# EAGLE schematic UE0083-Modulo PWM-V1.fsch (EAGLE 9.7.0)
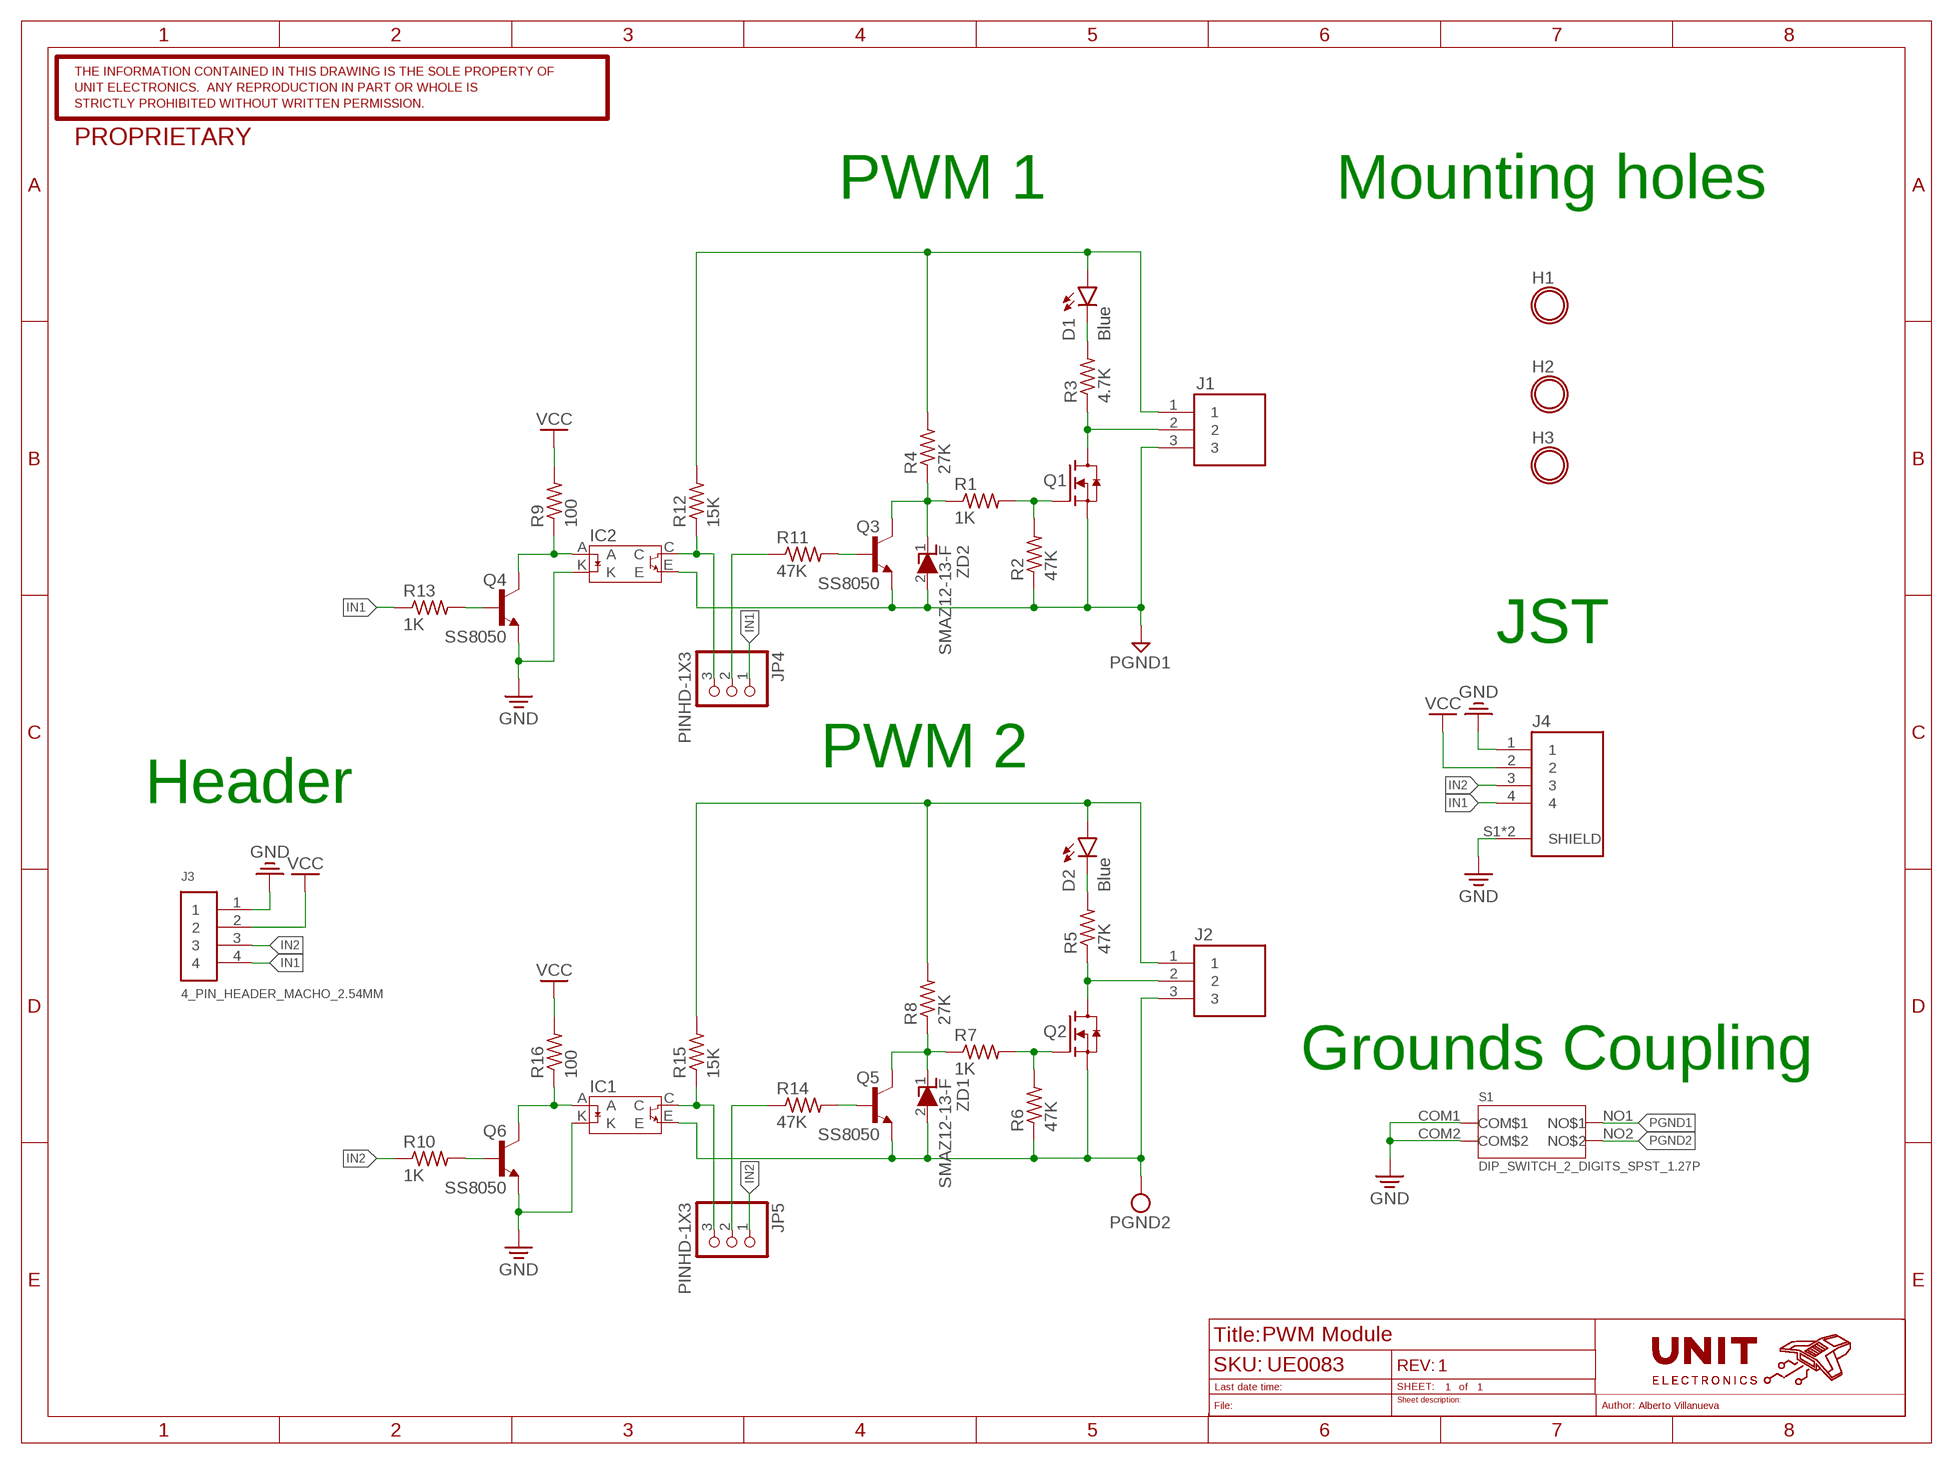
[diagram p0: schematic, sheet 1]

## Parts
D1  Blue  LED_SMD_0402  [0402_D]
D2  Blue  LED_SMD_0402  [0402_D]
H1  HOLE_PADM2-THICK  [M2-THICK-OUTLINE]
H2  HOLE_PADM2-THICK  [M2-THICK-OUTLINE]
H3  HOLE_PADM2-THICK  [M2-THICK-OUTLINE]
IC1  EL3H7BTA-G  [SSOP-4]
IC2  EL3H7BTA-G  [SSOP-4]
J1  BORNERA-KF301-3P  [KF301-5MM-3P]
J2  BORNERA-KF301-3P  [KF301-5MM-3P]
J3  4_PIN_HEADER_MACHO_2.54MM  4_PIN_HEADER_MACHO_2.54MMROUNDED  [4_PIN_HEADER_MACHO_2.54MM_ROUNDED]
J4  QWIIC_JST_SR_4PINES_1MMBM04B-SRSS-TB(LF)(SN)  [SMD,P=1MM,4P,VERTICAL]
JP4  PINHD-1X3  PINHD-1X31X3_SILKSCREEN  [1X3_PIN_HEADER_2.54MM_SILKSCREEN]
JP5  PINHD-1X3  PINHD-1X31X3_SILKSCREEN  [1X3_PIN_HEADER_2.54MM_SILKSCREEN]
Q1  HL4410  [SOP-8]
Q2  HL4410  [SOP-8]
Q3  SS8050  [TRANS_SS8050-G]
Q4  SS8050  [TRANS_SS8050-G]
Q5  SS8050  [TRANS_SS8050-G]
Q6  SS8050  [TRANS_SS8050-G]
R1  1K  RESISTOR_06030402_R  [0402_R]
R2  47K  RESISTOR_06030402_R  [0402_R]
R3  4.7K  RESISTOR_06030402_R  [0402_R]
R4  27K  RESISTOR_06030402_R  [0402_R]
R5  47K  RESISTOR_06030402_R  [0402_R]
R6  47K  RESISTOR_06030402_R  [0402_R]
R7  1K  RESISTOR_06030402_R  [0402_R]
R8  27K  RESISTOR_06030402_R  [0402_R]
R9  100  RESISTOR_SMD1206_R  [R1206]
R10  1K  RESISTOR_06030402_R  [0402_R]
R11  47K  RESISTOR_SMD0402_R  [0402_R]
R12  15K  RESISTOR_SMD  [0603_R]
R13  1K  RESISTOR_SMD0402_R  [0402_R]
R14  47K  RESISTOR_SMD0402_R  [0402_R]
R15  15K  RESISTOR_SMD  [0603_R]
R16  100  RESISTOR_SMD1206_R  [R1206]
S1  DIP_SWITCH_2_DIGITS_SPST_1.27P  [SMD-4P,4.1X5.4MM]
ZD1  SMAZ12-13-F  [SMA]
ZD2  SMAZ12-13-F  [SMA]

## Nets
GND: IC1.K IC2.K J3.1 J4.1 J4.S1(SHIELD) J4.S2(SHIELD) Q4.2(E) Q6.2(E) S1.COM1(COM$1) S1.COM2(COM$2)
IN1: J3.4 J4.4 JP4.1 R13.1
IN2: J3.3 J4.3 JP5.1 R10.1
N$1: Q3.1(B) R11.2
N$2: IC2.C JP4.3 R12.1
N$4: Q4.1(B) R13.2
N$5: JP4.2 R11.1
N$7: Q5.1(B) R14.2
N$8: IC1.C JP5.3 R15.1
N$9: JP5.2 R14.1
N$10: Q6.1(B) R10.2
N$171: IC1.A Q6.3(C) R16.1
N$175: D2.A J2.1 R8.2 R15.2
N$176: D2.C R5.2
N$177: Q5.3(C) R7.1 R8.1 ZD1.1(K)
N$178: Q2.P$4(G) R6.2 R7.2
N$180: J2.2 Q2.P$5(D) Q2.P$6(D) Q2.P$7(D) Q2.P$8(D) R5.1
N$182: IC2.A Q4.3(C) R9.1
N$184: Q3.3(C) R1.1 R4.1 ZD2.1(K)
N$185: D1.A J1.1 R4.2 R12.2
N$186: D1.C R3.2
N$188: Q1.P$4(G) R1.2 R2.2
N$190: J1.2 Q1.P$5(D) Q1.P$6(D) Q1.P$7(D) Q1.P$8(D) R3.1
PGND1: IC2.E J1.3 Q1.P$1(S) Q1.P$2(S) Q1.P$3(S) Q3.2(E) R2.1 S1.NO1(NO$1) ZD2.2(A)
PGND2: IC1.E J2.3 Q2.P$1(S) Q2.P$2(S) Q2.P$3(S) Q5.2(E) R6.1 S1.NO2(NO$2) ZD1.2(A)
VCC: J3.2 J4.2 R9.2 R16.2

## Notes on the sheet
- PWM 1 | Mounting holes
- JST
- PWM 2
- Header
- Grounds Coupling
- PWM Module
- UE0083 | 1
- Alberto Villanueva

## Library data of the parts
D1 D2 = Unit_Biblioteca - Optoelectronica:LED_SMD: LED SMD diferentes medidas Source: Datasheet <chrome-extension://efaidnbmnnnibpcajpcglclefindmkaj/https://datasheet.lcsc.com/szlcsc/1811081723_UNI-ROYAL-Uniroyal-Elec-0603WAF6803T5E_C25822.pdf> SKU: Propietario: UNIT Electronics Desarrollador:Federico Hidalgo; CLASS: Optoelectronics; DESCRIPTION: Chip LED; SKU: L_0402
H1-H3 = UNIT_Biblioteca - Mechanical:HOLE_PAD: Mounting holes with pad around Autor: Adrián Rabadan
IC1 IC2 = Unit_Biblioteca - Optoelectronica:EL3H7BTA-G: EL3H7(B)(TA)-G 4 PIN ULTRA SMALL SSOP PHOTOTRANSISTOR PHOTOCOUPLER Source: Datasheet <https://www.lcsc.com/datasheet/lcsc_datasheet_1811131510_Everlight-Elec-EL3H7-B-TA-G_C32565.pdf> SKU: N/A Propietario: UNIT Electronics Desarrollador: Alberto Villanueva; CLASS: Optoelectronics; DESCRIPTION: 80V 3.75kV 50mA 100mV@1mA,10mA 1 6V 1.2V DC SSOP-4-1.27mm Transistor, Photovoltaic Output Optoisolators ROHS; MANUFACTURER_NAME: Everlight Elec; MANUFACTURER_PART_NUMBER: EL3H7(B)(TA)-G; SKU: TST0126; VENDOR_PART_NUMBER: C32565; VENDOR_PRICE-STOCK: https://www.lcsc.com/product-detail/Transistor-Photovoltaic-Output-Optoisolators_Everlight-Elec-EL3H7-B-TA-G_C32565.html
J1 J2 = UNIT_Biblioteca Conectores:BORNERA-KF301-3P: Terminal Block 5mm Pitch 3 Poles Source: Datasheet <http://www.handsontec.com/dataspecs/terminal block-5mm.pdf> UNIT_PART_NUMBER:AR0315 AUTOR:Federico Hidalgo M; CLASS: Connectors; DESCRIPTION: 1x3P -30℃~+120℃ 17A 250V Blue 14~22 Direct Insert 5mm 1.5 1 3 Plugin,P=5mm Screw Terminal Blocks ROHS; MANUFACTURER_NAME: Cixi Kefa Elec; MANUFACTURER_PART_NUMBER: KF301-5.0-3P; SKU: SMT0056; VENDOR_PART_NUMBER: AR0315; VENDOR_PRICE-STOCK: https://uelectronics.com/producto/bornera-kf301-de-2-3-4-pines-5mm-paso-b/?attribute_bornera=3+pines
J3 = UNIT_Biblioteca Conectores:4_PIN_HEADER_MACHO_2.54MM: Header Macho Tira de 4 Pines 2.54mm Source: Datasheet <https://www.sparkfun.com/datasheets/Components/longerheaders.pdf> Propietario: UNIT Electronics Desarrollador: Alberto Villanueva; CLASS: Connectors; DESCRIPTION: Plugin,P=2.54 Pin Headers ROHS; MANUFACTURER_NAME: XYECONN; MANUFACTURER_PART_NUMBER: PZ2.54-UP1D-40A; SKU: SMT0040; VENDOR_PART_NUMBER: AR0164; VENDOR_PRICE-STOCK: https://uelectronics.com/producto/tira-header-macho-40p-2-54mm-diferentes-colores/
J4 = UNIT_Biblioteca Conectores:QWIIC_JST_SR_4PINES_1MM: Conector JST SR 4 Pines BM04B-SRSS-TB(LF)(SN) Source: Datasheet <https://datasheet.lcsc.com/szlcsc/2006181005_XKB-Connectivity-X1002WVS-04L-HF-LPSN_C400379.pdf> SKU: AR2423 Propietario: UNIT Electronics Desarrollador:Federico Hidalgo; CLASS: Connector; DESCRIPTION: Conector JST 4 Pines Vertical BM04B-SRSS-TB(LF)(SN); MANUFACTURER_NAME: JST; MANUFACTURER_PART_NUMBER: BM04B-SRSS-TB(LF)(SN); SKU: SMT0055; VENDOR_PART_NUMBER: AR2423; VENDOR_PRICE-STOCK: https://uelectronics.com/producto/conector-jst-sr-4-pines-vertical-bm04b-srss-tblfsn/
JP4 JP5 = UNIT_Biblioteca Conectores:PINHD-1X3: PIN HEADER; CLASS: Connectors; DESCRIPTION: Plugin,P=2.54 Pin Headers ROHS; MANUFACTURER_NAME: XYECONN; MANUFACTURER_PART_NUMBER: PZ2.54-UP1D-40A; SKU: SMT0040; VENDOR_PART_NUMBER: AR0164; VENDOR_PRICE-STOCK: https://uelectronics.com/producto/tira-header-macho-40p-2-54mm-diferentes-colores/
Q1 Q2 = UNIT_Biblioteca - Elementos Activos:HL4410: HL 4410 NChannel MOSFET 30V 18A 7mΩ 2.5V 1 N-Channel SOP-8 MOSFETs ROHS Source: Datasheet <https://www.lcsc.com/datasheet/lcsc_datasheet_2308071627_HL-4410_C7471105.pdf> SKU: n/a Propietario: UNIT Electronics Desarrollador: Alberto Villanueva; CLASS: Transistors; DESCRIPTION: 30V 18A 5W 11mΩ@4.5V,10A 1.5V@250uA 1 N-Channel SOP-8 MOSFETs ROHS; MANUFACTURER_NAME: HL; MANUFACTURER_PART_NUMBER: 4410; VENDOR_PART_NUMBER: C7471105; VENDOR_PRICE-STOCK: https://www.lcsc.com/product-detail/MOSFETs_HL-4410_C7471105.html
Q3-Q6 = UNIT_Biblioteca - Elementos Activos:SS8050: SS8050 NPN Transistor Bipolar (BJT) Transistor NPN 25 V 1.5 A 100MHz 300 mW Surface Mount SOT-23-3 Source: Datasheet <https://uelectronics.com/wp-content/uploads/2021/04/1811052004_Changjiang-Electronics-Tech-CJ-SS8050_C2150.pdf> SKU: AR2124 Propietario: UNIT Electronics Desarrollador: Alberto Villanueva; DESCRIPTION: Bipolar (BJT) Transistor NPN 25 V 1.5 A 100MHz 300 mW Surface Mount SOT-23-3; HEIGHT: 1.14 mm; MANUFACTURER_NAME: Comchip Technology; MANUFACTURER_PART_NAME: SS8050; UNIT_PART_NUMBER: AR2124; UNIT_PRICE-STOCK: https://uelectronics.com/producto/transistor-npn-1-5a-25v-ss8050/; WIDTH: 2.9 mm
R1-R8 R10 = UNIT_Bliblioteca - Elementos Pasivos:RESISTOR_0603: Resistencias SMD 0603 6.3mm diámetro x 7.7mm Source: Datasheet <chrome-extension://efaidnbmnnnibpcajpcglclefindmkaj/https://datasheet.lcsc.com/szlcsc/1811081723_UNI-ROYAL-Uniroyal-Elec-0603WAF6803T5E_C25822.pdf> SKU: Propietario: UNIT Electronics Desarrollador: Federico Hidalgo; CLASS: Resistor; DESCRIPTION: Chip Resistor 0402 1%; SKU: R_0402
R9 R16 = UNIT_Bliblioteca - Elementos Pasivos:RESISTOR_SMD: Resistencias SMD Source: Datasheet <chrome-extension://efaidnbmnnnibpcajpcglclefindmkaj/https://datasheet.lcsc.com/szlcsc/1811081723_UNI-ROYAL-Uniroyal-Elec-0603WAF6803T5E_C25822.pdf> SKU: Propietario: UNIT Electronics Desarrollador: Federico Hidalgo; CLASS: Resistor
R11 R13 R14 = UNIT_Bliblioteca - Elementos Pasivos:RESISTOR_SMD: Resistencias SMD Source: Datasheet <chrome-extension://efaidnbmnnnibpcajpcglclefindmkaj/https://datasheet.lcsc.com/szlcsc/1811081723_UNI-ROYAL-Uniroyal-Elec-0603WAF6803T5E_C25822.pdf> SKU: Propietario: UNIT Electronics Desarrollador: Federico Hidalgo; CLASS: Resistor; DESCRIPTION: Chip Resistor 0402 1%; SKU: R_0402
R12 R15 = UNIT_Bliblioteca - Elementos Pasivos:RESISTOR_SMD: Resistencias SMD Source: Datasheet <chrome-extension://efaidnbmnnnibpcajpcglclefindmkaj/https://datasheet.lcsc.com/szlcsc/1811081723_UNI-ROYAL-Uniroyal-Elec-0603WAF6803T5E_C25822.pdf> SKU: Propietario: UNIT Electronics Desarrollador: Federico Hidalgo; CLASS: Resistor; DESCRIPTION: Chip Resistor 0603 1%; SKU: R_0603
S1 = UNIT_Bilbioteca - Switches:DIP_SWITCH_2_DIGITS_SPST_1.27P: DIP Switch 4 Pin 1.27P 2 positions SPST Black Flat toggle, slotted SMD-4P,4.1x5.4mm DIP Switches ROHS Source: Datasheet <https://www.lcsc.com/datasheet/lcsc_datasheet_2309041406_DongGuan-KINGTEK-Industrial-Co--LTD-DSHP02TSGET_C40735.pdf> SKU: n/a Propietario: UNIT Electronics Desarrollador: Alberto Villanueva; CLASS: Switch; DESCRIPTION: 2 positions SPST Black Flat toggle, slotted SMD-4P,4.1x5.4mm DIP Switches ROHS; MANUFACTURER_NAME: DongGuan KINGTEK Industrial Co.,LTD; MANUFACTURER_PART_NUMBER: DSHP02TSGET; SKU: N/A; VENDOR_PART_NUMBER: C40735; VENDOR_PRICE-STOCK: https://www.lcsc.com/product-detail/DIP-Switches_DongGuan-KINGTEK-Industrial-Co-LTD-DSHP02TSGET_C40735.html
ZD1 ZD2 = UNIT_Biblioteca - Elementos Activos:SMAZ12-13-F: Source: Datasheet SKU: SMT Propietario: UNIT Electronics Desarrollador:; CLASS: Diodes; DESCRIPTION: Independent Type 11.4V~12.6V 1W 12V SMA(DO-214AC) Zener Diodes ROHS; MANUFACTURER_NAME: Diodes Incorporated; MANUFACTURER_PART_NUMBER: SMAZ12-13-F; SKU: TST0199; VENDOR_PART_NUMBER: AR2191; VENDOR_PRICE-STOCK: https://uelectronics.com/producto/zener-12v-1w-sma-smaz12-13-f/?srsltid=AfmBOorQXg4SEWYOIfBO3Hr2btF-IcP6YQTBPtMdZa3Kk-oVDFnJH5EY